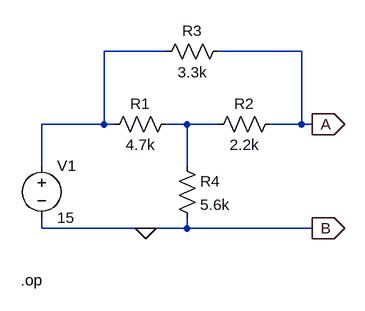
[diagram p0: schematic thevinin 2.asc]
thevinin 2.asc, the LTspice schematic file:
Version 4
SHEET 1 880 680
WIRE 256 -48 160 -48
WIRE 464 -48 336 -48
WIRE 160 64 160 -48
WIRE 160 64 64 64
WIRE 176 64 160 64
WIRE 288 64 256 64
WIRE 336 64 288 64
WIRE 464 64 464 -48
WIRE 464 64 416 64
WIRE 480 64 464 64
WIRE 64 128 64 64
WIRE 288 128 288 64
WIRE 64 224 64 208
WIRE 224 224 64 224
WIRE 288 224 288 208
WIRE 288 224 224 224
WIRE 480 224 288 224
FLAG 224 224 0
FLAG 480 64 A
IOPIN 480 64 Out
FLAG 480 224 B
IOPIN 480 224 Out
SYMBOL voltage 64 112 R0
SYMATTR InstName V1
SYMATTR Value 15
SYMBOL res 272 48 R90
WINDOW 0 0 56 VBottom 2
WINDOW 3 32 56 VTop 2
SYMATTR InstName R1
SYMATTR Value 4.7k
SYMBOL res 432 48 R90
WINDOW 0 0 56 VBottom 2
WINDOW 3 32 56 VTop 2
SYMATTR InstName R2
SYMATTR Value 2.2k
SYMBOL res 352 -64 R90
WINDOW 0 0 56 VBottom 2
WINDOW 3 32 56 VTop 2
SYMATTR InstName R3
SYMATTR Value 3.3k
SYMBOL res 272 112 R0
SYMATTR InstName R4
SYMATTR Value 5.6k
TEXT 32 304 Left 2 !.op

The netlist it stands for:
* thevinin 2.asc
V1 N001 0 15
R1 N002 N001 4.7k
R2 A N002 2.2k
R3 A N001 3.3k
R4 N002 0 5.6k
.op
.backanno
.end